# EasyEDA schematic arduinolcd_2020-11-17_19-29-00.json
TITLE: Sheet_1; REV: 1.0; Date: 2020-11-17; Sheet: 1/1; Drawn By: Dan; Company: Your Company
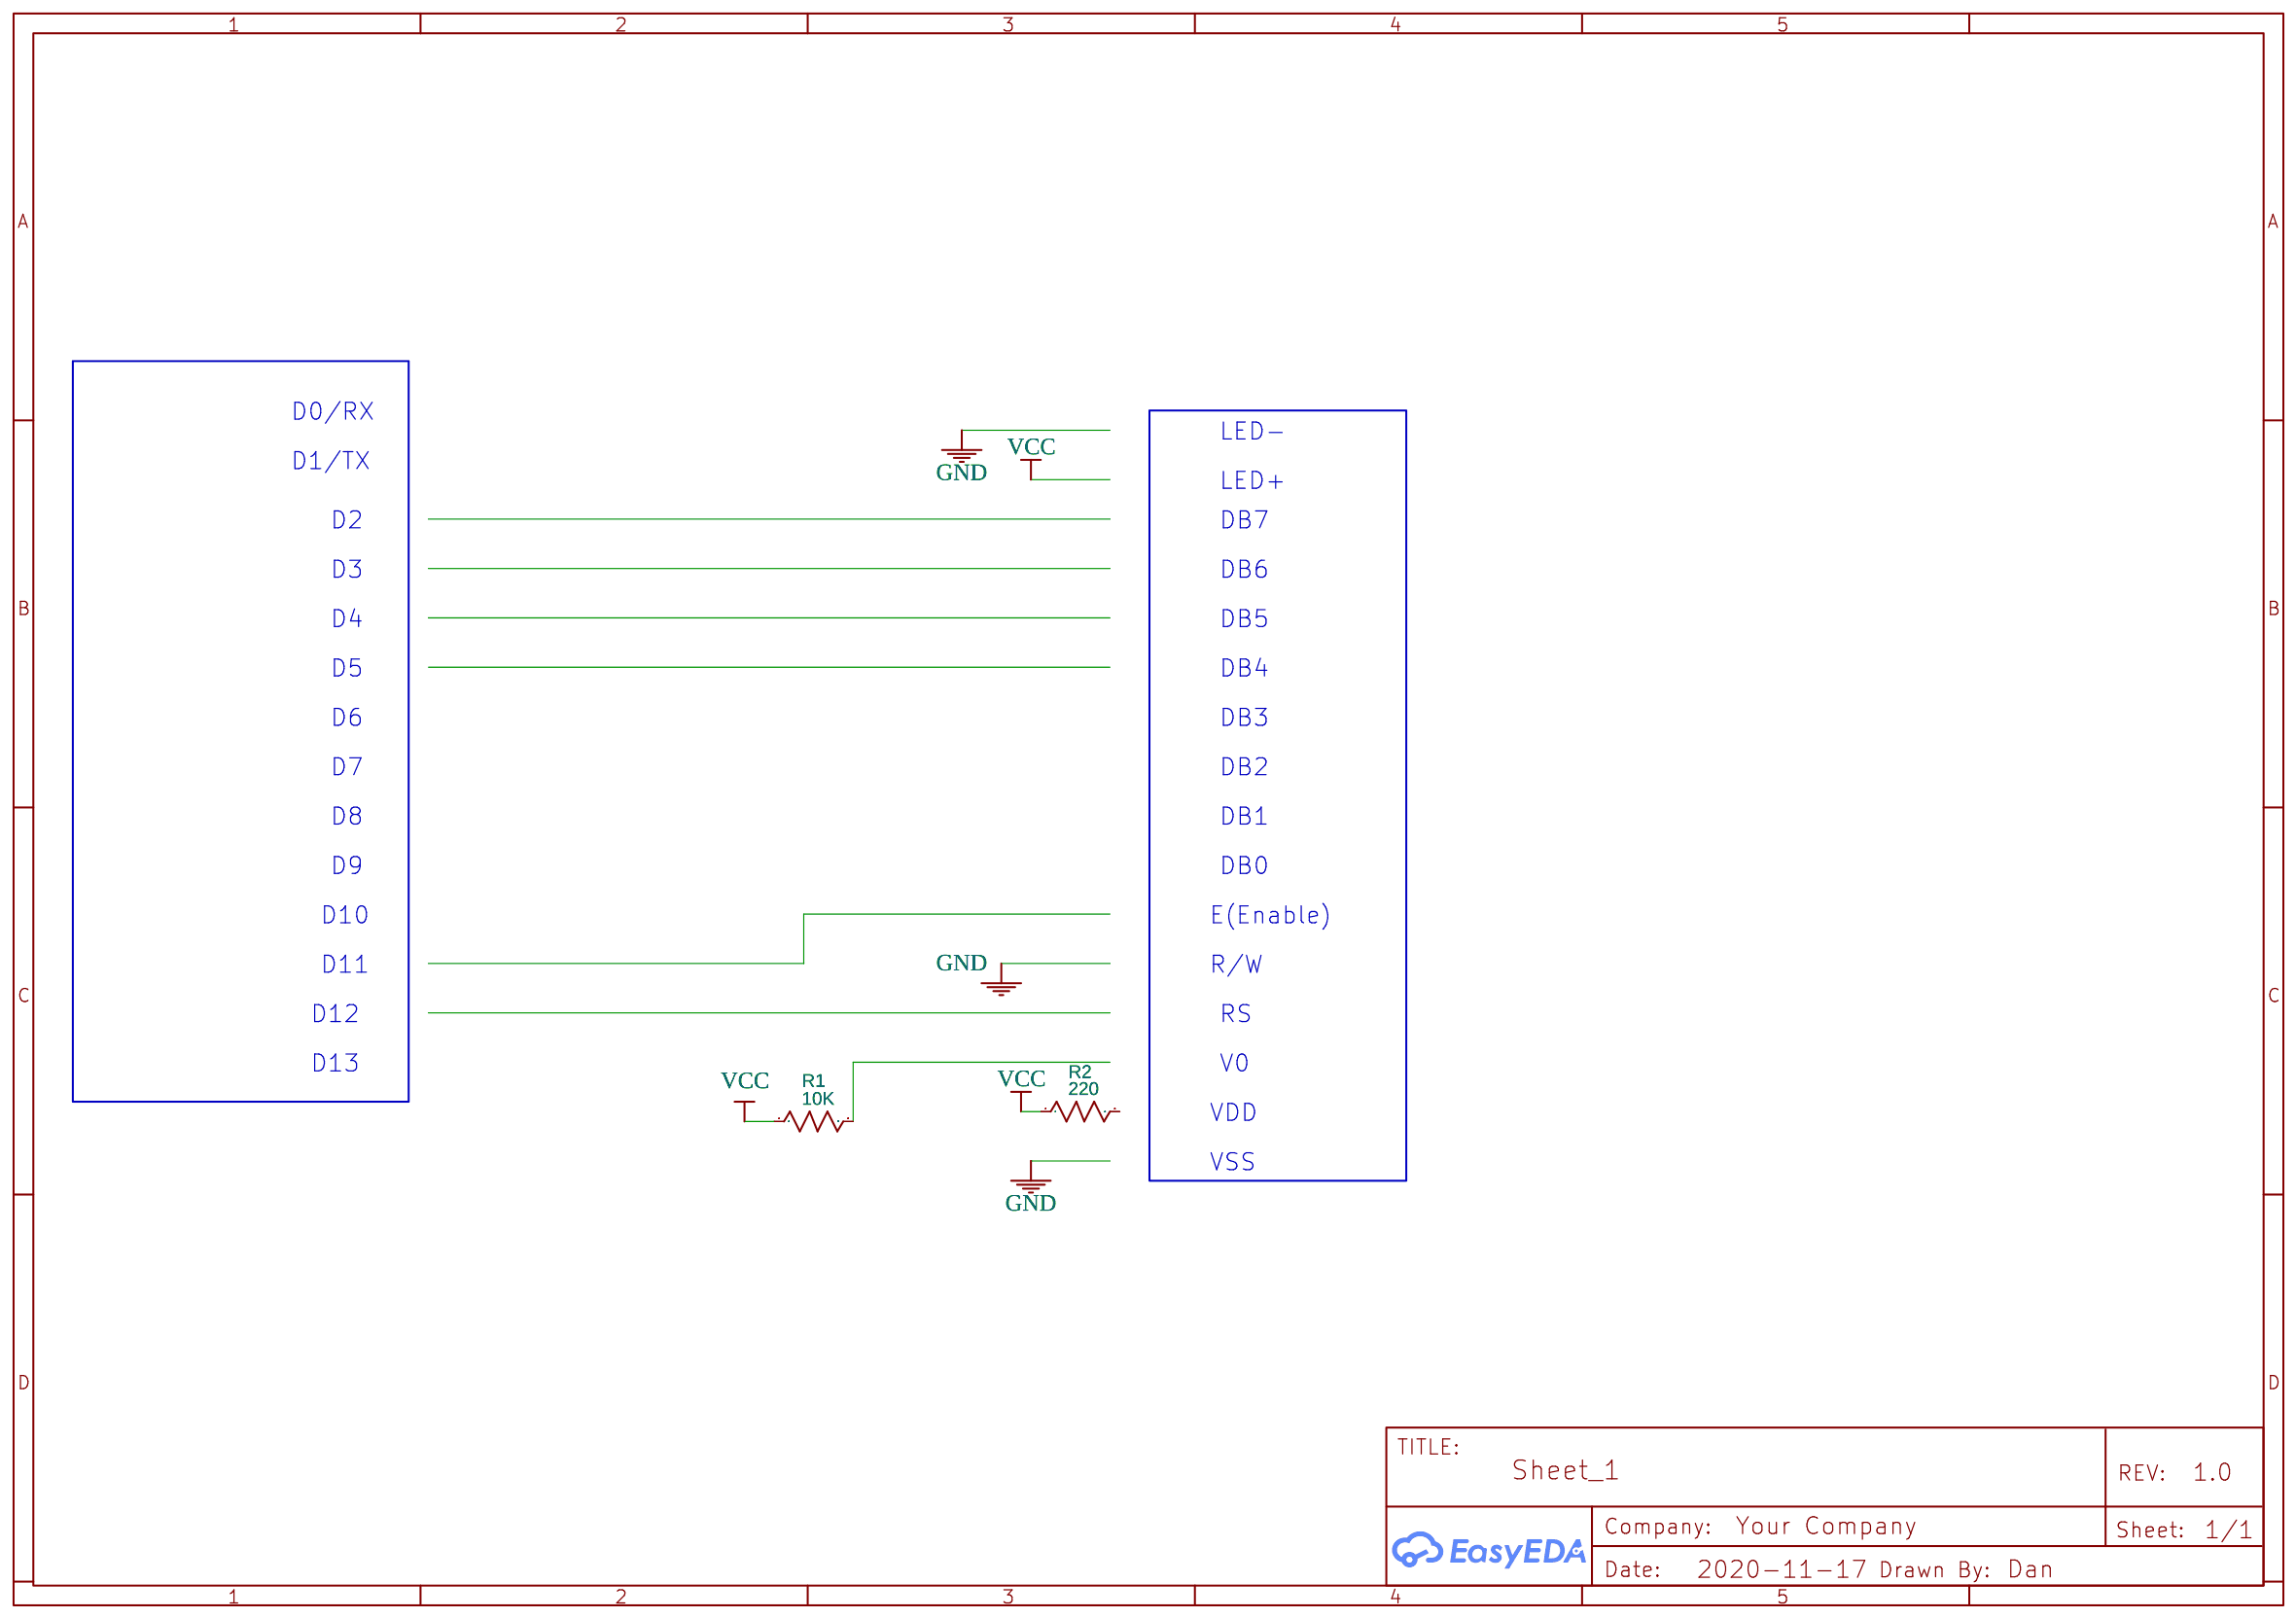
[diagram p0: schematic sheet]

## Parts
R1  10K  [R0603]
R2  220  [R0603]

## Library data of the parts
R1 R2 = R_0603_US: Contributor: LCEDA_Lib

## Nets
VCC: R1.1 R2.1

Not connected (* = marked no-connect by the designer): R1 2; R2 2

## Notes on the sheet
- D0/RX
- LED-
- D1/TX
- LED+
- D2
- DB7
- D3
- DB6
- D4
- DB5
- D5
- DB4
- D6
- DB3
- D7
- DB2
- D8
- DB1
- D9
- DB0
- D10
- E(Enable)
- D11
- R/W
- D12
- RS
- D13
- V0
- VDD
- VSS
